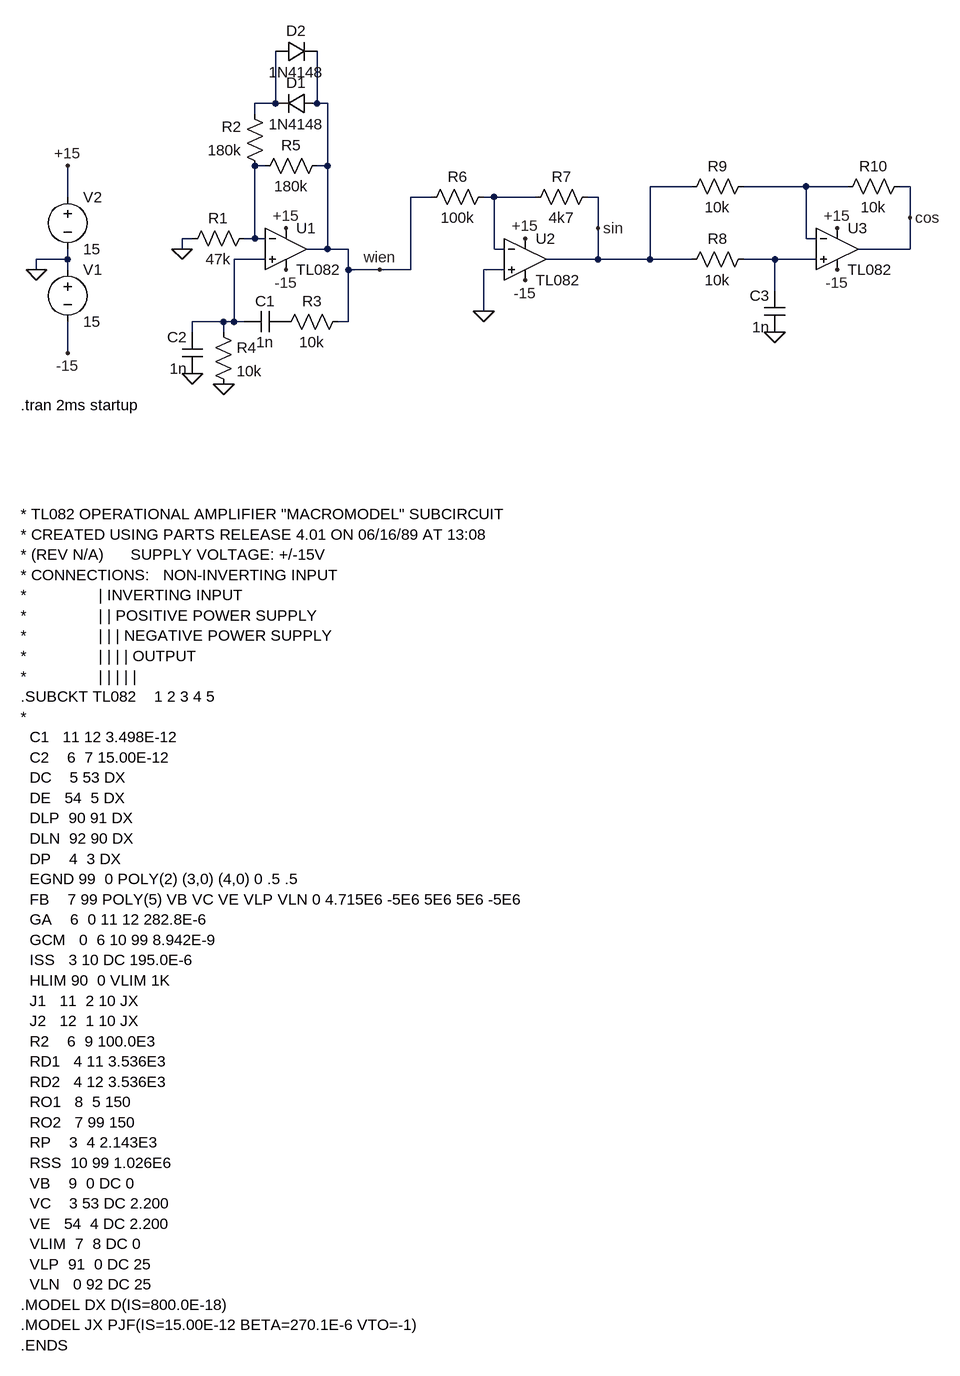
[diagram p0: schematic osc_wien.asc]
osc_wien.asc, the LTspice schematic file:
Version 4
SHEET 1 1644 1700
WIRE 144 -96 144 -176
WIRE 144 -96 112 -96
WIRE 208 -96 208 -176
WIRE 224 -96 208 -96
WIRE 112 -80 112 -96
WIRE 128 0 112 0
WIRE 224 0 224 -96
WIRE 224 0 208 0
WIRE 784 32 720 32
WIRE 960 32 864 32
WIRE 1024 32 960 32
WIRE 1120 32 1104 32
WIRE -176 48 -176 0
WIRE 384 48 352 48
WIRE 480 48 464 48
WIRE 544 48 480 48
WIRE 640 48 624 48
WIRE 1120 80 1120 32
WIRE 640 96 640 48
WIRE 16 112 0 112
WIRE 112 112 112 0
WIRE 112 112 96 112
WIRE 128 112 112 112
WIRE 960 112 960 32
WIRE 976 112 960 112
WIRE 0 128 0 112
WIRE 224 128 224 0
WIRE 224 128 192 128
WIRE 256 128 224 128
WIRE 480 128 480 48
WIRE 496 128 480 128
WIRE 1120 128 1120 80
WIRE 1120 128 1040 128
WIRE -176 144 -176 128
WIRE -176 144 -224 144
WIRE 128 144 80 144
WIRE 640 144 640 96
WIRE 640 144 560 144
WIRE 720 144 720 32
WIRE 720 144 640 144
WIRE 784 144 720 144
WIRE 912 144 864 144
WIRE 976 144 912 144
WIRE -224 160 -224 144
WIRE -176 160 -176 144
WIRE 256 160 256 128
WIRE 304 160 256 160
WIRE 352 160 352 48
WIRE 352 160 304 160
WIRE 496 160 464 160
WIRE 912 192 912 144
WIRE 464 224 464 160
WIRE 64 240 16 240
WIRE 80 240 80 144
WIRE 80 240 64 240
WIRE 96 240 80 240
WIRE 256 240 256 160
WIRE 256 240 240 240
WIRE 16 256 16 240
WIRE 64 256 64 240
WIRE -176 288 -176 240
FLAG 0 128 0
FLAG 16 320 0
FLAG 64 336 0
FLAG -224 160 0
FLAG -176 0 +15
FLAG -176 288 -15
FLAG 160 160 -15
FLAG 160 96 +15
FLAG 528 112 +15
FLAG 528 176 -15
FLAG 464 224 0
FLAG 304 160 wien
FLAG 640 96 sin
FLAG 912 256 0
FLAG 1008 96 +15
FLAG 1008 160 -15
FLAG 1120 80 cos
SYMBOL Opamps\\opamp2 160 64 R0
SYMATTR InstName U1
SYMATTR Value TL082
SYMBOL res 112 96 R90
WINDOW 0 0 56 VBottom 2
WINDOW 3 32 56 VTop 2
SYMATTR InstName R1
SYMATTR Value 47k
SYMBOL res 128 16 R180
WINDOW 0 36 76 Left 2
WINDOW 3 36 40 Left 2
SYMATTR InstName R2
SYMATTR Value 180k
SYMBOL res 256 224 R90
WINDOW 0 0 56 VBottom 2
WINDOW 3 32 56 VTop 2
SYMATTR InstName R3
SYMATTR Value 10k
SYMBOL cap 160 224 R90
WINDOW 0 0 32 VBottom 2
WINDOW 3 32 32 VTop 2
SYMATTR InstName C1
SYMATTR Value 1n
SYMBOL cap 32 320 R180
WINDOW 0 24 56 Left 2
WINDOW 3 24 8 Left 2
SYMATTR InstName C2
SYMATTR Value 1n
SYMBOL res 48 240 R0
SYMATTR InstName R4
SYMATTR Value 10k
SYMBOL voltage -176 144 R0
SYMATTR InstName V1
SYMATTR Value 15
SYMBOL voltage -176 32 R0
SYMATTR InstName V2
SYMATTR Value 15
SYMBOL diode 208 -112 R90
WINDOW 0 0 32 VBottom 2
WINDOW 3 32 32 VTop 2
SYMATTR InstName D1
SYMATTR Value 1N4148
SYMBOL diode 144 -160 R270
WINDOW 0 32 32 VTop 2
WINDOW 3 0 32 VBottom 2
SYMATTR InstName D2
SYMATTR Value 1N4148
SYMBOL res 112 16 R270
WINDOW 0 32 56 VTop 2
WINDOW 3 0 56 VBottom 2
SYMATTR InstName R5
SYMATTR Value 180k
SYMBOL Opamps\\opamp2 528 80 R0
SYMATTR InstName U2
SYMATTR Value TL082
SYMBOL res 480 32 R90
WINDOW 0 0 56 VBottom 2
WINDOW 3 32 56 VTop 2
SYMATTR InstName R6
SYMATTR Value 100k
SYMBOL res 640 32 R90
WINDOW 0 0 56 VBottom 2
WINDOW 3 32 56 VTop 2
SYMATTR InstName R7
SYMATTR Value 4k7
SYMBOL res 880 128 R90
WINDOW 0 0 56 VBottom 2
WINDOW 3 32 56 VTop 2
SYMATTR InstName R8
SYMATTR Value 10k
SYMBOL cap 928 256 R180
WINDOW 0 24 56 Left 2
WINDOW 3 24 8 Left 2
SYMATTR InstName C3
SYMATTR Value 1n
SYMBOL Opamps\\opamp2 1008 64 R0
SYMATTR InstName U3
SYMATTR Value TL082
SYMBOL res 880 16 R90
WINDOW 0 0 56 VBottom 2
WINDOW 3 32 56 VTop 2
SYMATTR InstName R9
SYMATTR Value 10k
SYMBOL res 1120 16 R90
WINDOW 0 0 56 VBottom 2
WINDOW 3 32 56 VTop 2
SYMATTR InstName R10
SYMATTR Value 10k
TEXT -248 368 Left 2 !.tran 2ms startup
TEXT -248 536 Left 2 !* TL082 OPERATIONAL AMPLIFIER "MACROMODEL" SUBCIRCUIT\n* CREATED USING PARTS RELEASE 4.01 ON 06/16/89 AT 13:08\n* (REV N/A)      SUPPLY VOLTAGE: +/-15V\n* CONNECTIONS:   NON-INVERTING INPUT\n*                | INVERTING INPUT\n*                | | POSITIVE POWER SUPPLY\n*                | | | NEGATIVE POWER SUPPLY\n*                | | | | OUTPUT\n*                | | | | |\n.SUBCKT TL082    1 2 3 4 5\n*\n  C1   11 12 3.498E-12\n  C2    6  7 15.00E-12\n  DC    5 53 DX\n  DE   54  5 DX\n  DLP  90 91 DX\n  DLN  92 90 DX\n  DP    4  3 DX\n  EGND 99  0 POLY(2) (3,0) (4,0) 0 .5 .5\n  FB    7 99 POLY(5) VB VC VE VLP VLN 0 4.715E6 -5E6 5E6 5E6 -5E6\n  GA    6  0 11 12 282.8E-6\n  GCM   0  6 10 99 8.942E-9\n  ISS   3 10 DC 195.0E-6\n  HLIM 90  0 VLIM 1K\n  J1   11  2 10 JX\n  J2   12  1 10 JX\n  R2    6  9 100.0E3\n  RD1   4 11 3.536E3\n  RD2   4 12 3.536E3\n  RO1   8  5 150\n  RO2   7 99 150\n  RP    3  4 2.143E3\n  RSS  10 99 1.026E6\n  VB    9  0 DC 0\n  VC    3 53 DC 2.200\n  VE   54  4 DC 2.200\n  VLIM  7  8 DC 0\n  VLP  91  0 DC 25\n  VLN   0 92 DC 25\n.MODEL DX D(IS=800.0E-18)\n.MODEL JX PJF(IS=15.00E-12 BETA=270.1E-6 VTO=-1)\n.ENDS

The netlist it stands for:
* osc_wien.asc
XU1 N005 N002 +15 -15 wien TL082  ; pins In+ In- V+ V- OUT
R1 N002 0 47k
R2 N002 N001 180k
R3 wien P001 10k
C1 P001 N005 1n
C2 0 N005 1n
R4 N005 0 10k
V1 0 -15 15
V2 +15 0 15
D1 wien N001 1N4148
D2 N001 wien 1N4148
R5 N002 wien 180k
XU2 0 N004 +15 -15 sin TL082  ; pins In+ In- V+ V- OUT
R6 N004 wien 100k
R7 sin N004 4k7
R8 N006 sin 10k
C3 0 N006 1n
XU3 N006 N003 +15 -15 cos TL082  ; pins In+ In- V+ V- OUT
R9 N003 sin 10k
R10 cos N003 10k
.model D D
.lib standard.dio
.tran 2ms startup
* TL082 OPERATIONAL AMPLIFIER "MACROMODEL" SUBCIRCUIT
* CREATED USING PARTS RELEASE 4.01 ON 06/16/89 AT 13:08
* (REV N/A)      SUPPLY VOLTAGE: +/-15V
* CONNECTIONS:   NON-INVERTING INPUT
*                | INVERTING INPUT
*                | | POSITIVE POWER SUPPLY
*                | | | NEGATIVE POWER SUPPLY
*                | | | | OUTPUT
*                | | | | |
.SUBCKT TL082    1 2 3 4 5
*
  C1   11 12 3.498E-12
  C2    6  7 15.00E-12
  DC    5 53 DX
  DE   54  5 DX
  DLP  90 91 DX
  DLN  92 90 DX
  DP    4  3 DX
  EGND 99  0 POLY(2) (3,0) (4,0) 0 .5 .5
  FB    7 99 POLY(5) VB VC VE VLP VLN 0 4.715E6 -5E6 5E6 5E6 -5E6
  GA    6  0 11 12 282.8E-6
  GCM   0  6 10 99 8.942E-9
  ISS   3 10 DC 195.0E-6
  HLIM 90  0 VLIM 1K
  J1   11  2 10 JX
  J2   12  1 10 JX
  R2    6  9 100.0E3
  RD1   4 11 3.536E3
  RD2   4 12 3.536E3
  RO1   8  5 150
  RO2   7 99 150
  RP    3  4 2.143E3
  RSS  10 99 1.026E6
  VB    9  0 DC 0
  VC    3 53 DC 2.200
  VE   54  4 DC 2.200
  VLIM  7  8 DC 0
  VLP  91  0 DC 25
  VLN   0 92 DC 25
.MODEL DX D(IS=800.0E-18)
.MODEL JX PJF(IS=15.00E-12 BETA=270.1E-6 VTO=-1)
.ENDS
.backanno
.end